# Altium schematic sheet Core.SchDoc
size A4; Organization: Altium Limited; Address1: L3, 12a Rodborough Rd; Address2: Frenchs Forest; Address3: NSW; Address4: Australia 2086
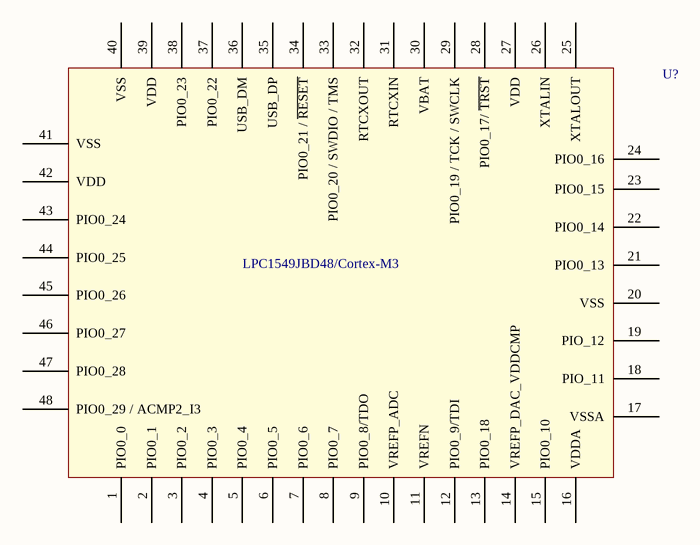
[diagram p0: Core.SchDoc]

## Parts
U?  LPC1549  [LPC1549JBD48]  (value not drawn)

## Nets

Not connected (* = marked no-connect by the designer): U? 1(PIO0_0) 2(PIO0_1) 3(PIO0_2) 4(PIO0_3) 5(PIO0_4) 6(PIO0_5) 7(PIO0_6) 8(PIO0_7) 9(PIO0_8/TDO) 10(VREFP_ADC) 11(VREFN) 12(PIO0_9/TDI) 13(PIO0_18) 14(VREFP_DAC_VDDCMP) 15(PIO0_10) 16(VDDA) 17(VSSA) 18(PIO_11) 19(PIO_12) 20(VSS) 21(PIO0_13) 22(PIO0_14) 23(PIO0_15) 24(PIO0_16) 25(XTALOUT) 26(XTALIN) 27(VDD) 28(PIO0_17/_~{TRST}) 29(PIO0_19_/_TCK_/_SWCLK) 30(VBAT) 31(RTCXIN) 32(RTCXOUT) 33(PIO0_20_/_SWDIO_/_TMS) 34(PIO0_21_/_~{RESET}) 35(USB_DP) 36(USB_DM) 37(PIO0_22) 38(PIO0_23) 39(VDD) 40(VSS) 41(VSS) 42(VDD) 43(PIO0_24) 44(PIO0_25) 45(PIO0_26) 46(PIO0_27) 47(PIO0_28) 48(PIO0_29_/_ACMP2_I3)

## Notes on the sheet
- Title
- Size:
- Date:
- A4
- Number:
- Time:
- Revision:
- Sheet
- of
- File:
- (in symbol LPC1549JBD48) LPC1549JBD48/Cortex-M3

## Library data of the parts
U? = LPC1549JBD48